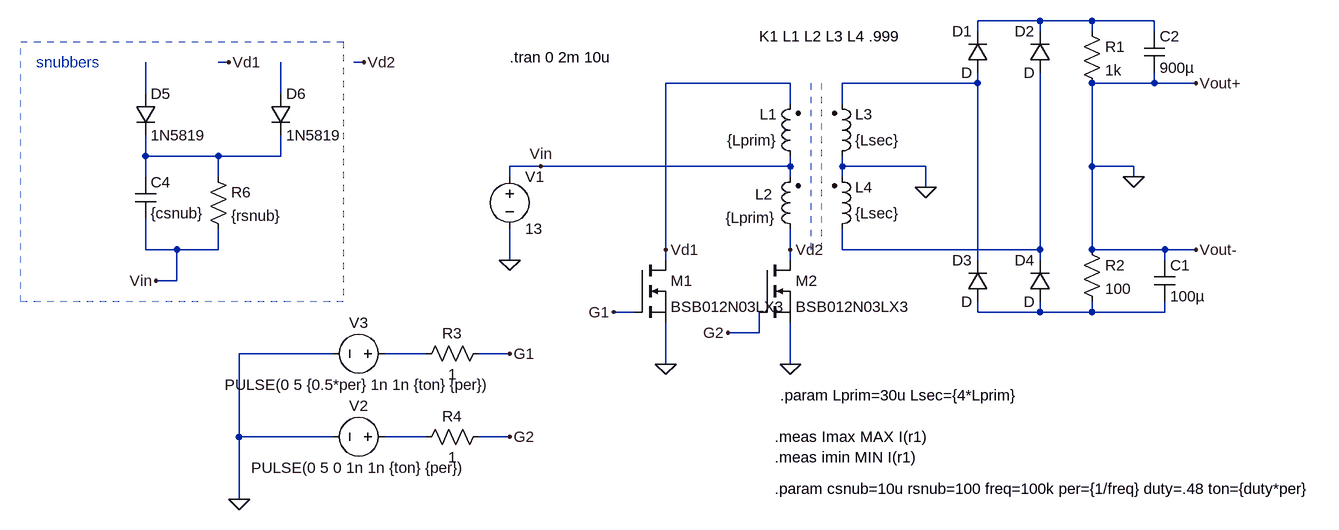
[diagram p0: schematic push-pull.asc]
push-pull.asc, the LTspice schematic file:
Version 4
SHEET 1 1304 720
WIRE 496 -80 400 -80
WIRE 576 -80 496 -80
WIRE 672 -80 576 -80
WIRE 400 -64 400 -80
WIRE 496 -64 496 -80
WIRE 576 -64 576 -80
WIRE 672 -64 672 -80
WIRE -752 -16 -768 -16
WIRE -544 -16 -560 -16
WIRE 112 16 -80 16
WIRE 400 16 400 0
WIRE 400 16 192 16
WIRE 672 16 672 0
WIRE 672 16 576 16
WIRE 736 16 672 16
WIRE -880 32 -880 -16
WIRE -672 32 -672 -16
WIRE 112 48 112 16
WIRE 192 48 192 16
WIRE -880 128 -880 96
WIRE -768 128 -880 128
WIRE -672 128 -672 96
WIRE -672 128 -768 128
WIRE -272 144 -320 144
WIRE 112 144 112 128
WIRE 112 144 -272 144
WIRE 192 144 192 128
WIRE 320 144 192 144
WIRE 576 144 576 16
WIRE 640 144 576 144
WIRE -880 160 -880 128
WIRE -768 160 -768 128
WIRE -320 160 -320 144
WIRE 112 160 112 144
WIRE 192 160 192 144
WIRE 640 160 640 144
WIRE 320 176 320 144
WIRE -880 272 -880 224
WIRE -832 272 -880 272
WIRE -768 272 -768 240
WIRE -768 272 -832 272
WIRE -80 272 -80 16
WIRE 112 272 112 240
WIRE 192 272 192 240
WIRE 496 272 496 0
WIRE 496 272 192 272
WIRE 576 272 576 144
WIRE 688 272 576 272
WIRE 736 272 688 272
WIRE -320 288 -320 240
WIRE -80 288 -80 272
WIRE 112 288 112 272
WIRE 400 288 400 16
WIRE 496 288 496 272
WIRE 688 288 688 272
WIRE -832 320 -832 272
WIRE -832 320 -864 320
WIRE -128 368 -160 368
WIRE 400 368 400 352
WIRE 496 368 496 352
WIRE 496 368 400 368
WIRE 576 368 576 352
WIRE 576 368 496 368
WIRE 688 368 688 352
WIRE 688 368 576 368
WIRE 64 400 64 368
WIRE 64 400 16 400
WIRE -592 432 -736 432
WIRE -448 432 -512 432
WIRE -320 432 -368 432
WIRE -80 448 -80 384
WIRE 112 448 112 384
WIRE -736 560 -736 432
WIRE -592 560 -736 560
WIRE -448 560 -512 560
WIRE -320 560 -368 560
WIRE -736 656 -736 560
FLAG 112 448 0
FLAG -320 288 0
FLAG -736 656 0
FLAG -80 448 0
FLAG -320 432 G1
FLAG -320 560 G2
FLAG -160 368 G1
FLAG 16 400 G2
FLAG -272 144 Vin
FLAG 112 272 Vd2
FLAG -80 272 Vd1
FLAG 320 176 0
FLAG 640 160 0
FLAG -544 -16 Vd2
FLAG -752 -16 Vd1
FLAG -864 320 Vin
FLAG 736 16 Vout+
FLAG 736 272 Vout-
SYMBOL nmos 64 288 R0
SYMATTR InstName M2
SYMATTR Value BSB012N03LX3
SYMBOL ind2 128 144 R180
WINDOW 0 36 80 Left 2
WINDOW 3 36 40 Left 2
SYMATTR InstName L1
SYMATTR Value {Lprim}
SYMBOL ind2 176 144 M180
WINDOW 0 36 80 Left 2
WINDOW 3 36 40 Left 2
SYMATTR InstName L3
SYMATTR Value {Lsec}
SYMBOL voltage -320 144 R0
WINDOW 123 0 0 Left 0
WINDOW 39 0 0 Left 0
SYMATTR InstName V1
SYMATTR Value 13
SYMBOL voltage -496 560 R90
WINDOW 0 -32 56 VBottom 2
WINDOW 3 32 56 VTop 2
WINDOW 123 0 0 Left 0
WINDOW 39 0 0 Left 0
SYMATTR InstName V2
SYMATTR Value PULSE(0 5 0 1n 1n {ton} {per})
SYMBOL ind2 128 256 R180
WINDOW 0 43 69 Left 2
WINDOW 3 38 33 Left 2
SYMATTR InstName L2
SYMATTR Value {Lprim}
SYMBOL nmos -128 288 R0
SYMATTR InstName M1
SYMATTR Value BSB012N03LX3
SYMBOL voltage -496 432 R90
WINDOW 0 -32 56 VBottom 2
WINDOW 3 32 56 VTop 2
WINDOW 123 0 0 Left 0
WINDOW 39 0 0 Left 0
SYMATTR InstName V3
SYMATTR Value PULSE(0 5 {0.5*per} 1n 1n {ton} {per})
SYMBOL res -352 416 R90
WINDOW 0 0 56 VBottom 2
WINDOW 3 32 56 VTop 2
SYMATTR InstName R3
SYMATTR Value 1
SYMBOL res -352 544 R90
WINDOW 0 0 56 VBottom 2
WINDOW 3 32 56 VTop 2
SYMATTR InstName R4
SYMATTR Value 1
SYMBOL ind2 176 256 M180
WINDOW 0 36 80 Left 2
WINDOW 3 36 40 Left 2
SYMATTR InstName L4
SYMATTR Value {Lsec}
SYMBOL diode 416 0 R180
WINDOW 0 24 64 Left 2
WINDOW 3 24 0 Left 2
SYMATTR InstName D1
SYMBOL diode 512 0 R180
WINDOW 0 24 64 Left 2
WINDOW 3 24 0 Left 2
SYMATTR InstName D2
SYMBOL diode 416 352 R180
WINDOW 0 24 64 Left 2
WINDOW 3 24 0 Left 2
SYMATTR InstName D3
SYMBOL diode 512 352 R180
WINDOW 0 24 64 Left 2
WINDOW 3 24 0 Left 2
SYMATTR InstName D4
SYMBOL cap 672 288 R0
SYMATTR InstName C1
SYMATTR Value 100µ
SYMBOL cap 656 -64 R0
SYMATTR InstName C2
SYMATTR Value 900µ
SYMBOL res 560 -80 R0
SYMATTR InstName R1
SYMATTR Value 1k
SYMBOL res 560 256 R0
SYMATTR InstName R2
SYMATTR Value 100
SYMBOL diode -896 32 R0
SYMATTR InstName D5
SYMATTR Value 1N5819
SYMBOL diode -688 32 R0
SYMATTR InstName D6
SYMATTR Value 1N5819
SYMBOL cap -896 160 R0
SYMATTR InstName C4
SYMATTR Value {csnub}
SYMBOL res -784 144 R0
SYMATTR InstName R6
SYMATTR Value {rsnub}
TEXT 64 -56 Left 2 !K1 L1 L2 L3 L4 .999
TEXT -320 -24 Left 2 !.tran 0 2m 10u
TEXT 88 560 Left 2 !.meas Imax MAX I(r1)\n.meas imin MIN I(r1)
TEXT -1048 -16 Left 2 ;snubbers
TEXT 88 640 Left 2 !.param csnub=10u rsnub=100 freq=100k per={1/freq} duty=.48 ton={duty*per}
TEXT 96 496 Left 2 !.param Lprim=30u Lsec={4*Lprim}
LINE Normal 144 272 144 16 2
LINE Normal 160 272 160 16 2
RECTANGLE Normal -576 352 -1072 -48 2

The netlist it stands for:
* push-pull.asc
M2 Vd2 G2 0 0 BSB012N03LX3
L1 Vin Vd1 {Lprim}
L3 0 N002 {Lsec}
V1 Vin 0 13
V2 N009 0 PULSE(0 5 0 1n 1n {ton} {per})
L2 Vd2 Vin {Lprim}
M1 Vd1 G1 0 0 BSB012N03LX3
V3 N008 0 PULSE(0 5 {0.5*per} 1n 1n {ton} {per})
R3 G1 N008 1
R4 G2 N009 1
L4 N006 0 {Lsec}
D1 N002 N001 D
D2 N006 N001 D
D3 N007 N002 D
D4 N007 N006 D
C1 0 N007 100µ
C2 N001 0 900µ
R1 N001 0 1k
R2 0 N007 100
D5 N003 N005 1N5819
D6 N004 N005 1N5819
C4 N005 Vin {csnub}
R6 N005 Vin {rsnub}
.model D D
.lib standard.dio
.model NMOS NMOS
.model PMOS PMOS
.lib standard.mos
K1 L1 L2 L3 L4 .999
.tran 0 2m 10u
.meas Imax MAX I(r1)
.meas imin MIN I(r1)
* snubbers
.param csnub=10u rsnub=100 freq=100k per={1/freq} duty=.48 ton={duty*per}
.param Lprim=30u Lsec={4*Lprim}
.backanno
.end